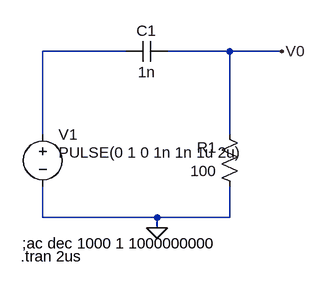
[diagram p0: schematic 1c.asc]
1c.asc, the LTspice schematic file:
Version 4
SHEET 1 880 680
WIRE 64 16 -64 16
WIRE 224 16 128 16
WIRE 304 16 224 16
WIRE -64 144 -64 16
WIRE 224 144 224 16
WIRE -64 272 -64 224
WIRE 112 272 -64 272
WIRE 224 272 224 224
WIRE 224 272 112 272
WIRE 112 288 112 272
FLAG 112 288 0
FLAG 304 16 V0
SYMBOL voltage -64 128 R0
WINDOW 3 24 44 Left 0
WINDOW 123 24 44 Left 0
WINDOW 39 0 0 Left 0
SYMATTR Value PULSE(0 1 0 1n 1n 1u 2u)
SYMATTR InstName V1
SYMBOL res 240 240 R180
WINDOW 0 36 76 Left 0
WINDOW 3 36 40 Left 0
SYMATTR InstName R1
SYMATTR Value 100
SYMBOL cap 128 0 R90
WINDOW 0 0 32 VBottom 0
WINDOW 3 32 32 VTop 0
SYMATTR InstName C1
SYMATTR Value 1n
TEXT -96 312 Left 0 !;ac dec 1000 1 1000000000
TEXT -98 332 Left 0 !.tran 2us

The netlist it stands for:
* 1c.asc
V1 N001 0 PULSE(0 1 0 1n 1n 1u 2u)
R1 0 V0 100
C1 V0 N001 1n
;ac dec 1000 1 1000000000
.tran 2us
.backanno
.end